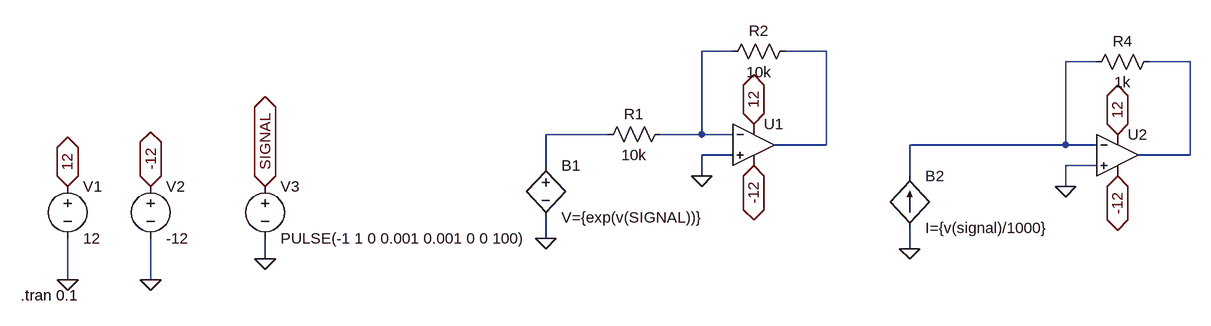
[diagram p0: schematic Arbitrary sources.asc]
Arbitrary sources.asc, the LTspice schematic file:
Version 4
SHEET 1 1140 680
WIRE 432 -64 384 -64
WIRE 576 -64 512 -64
WIRE 992 -48 944 -48
WIRE 1136 -48 1072 -48
WIRE 240 64 144 64
WIRE 384 64 384 -64
WIRE 384 64 320 64
WIRE 432 64 384 64
WIRE 576 80 576 -64
WIRE 576 80 496 80
WIRE 944 80 944 -48
WIRE 944 80 704 80
WIRE 992 80 944 80
WIRE 432 96 384 96
WIRE 1136 96 1136 -48
WIRE 1136 96 1056 96
WIRE 144 112 144 64
WIRE 992 112 944 112
WIRE 384 128 384 96
WIRE 704 128 704 80
WIRE 944 144 944 112
WIRE 144 224 144 192
WIRE 704 240 704 208
WIRE -288 256 -288 224
WIRE -592 288 -592 224
WIRE -464 288 -464 224
FLAG 384 128 0
FLAG -592 288 0
FLAG -464 288 0
FLAG -592 144 12
IOPIN -592 144 BiDir
FLAG -464 144 -12
IOPIN -464 144 BiDir
FLAG 144 224 0
FLAG 464 112 -12
IOPIN 464 112 BiDir
FLAG 464 48 12
IOPIN 464 48 BiDir
FLAG 944 144 0
FLAG 704 240 0
FLAG 1024 128 -12
IOPIN 1024 128 BiDir
FLAG 1024 64 12
IOPIN 1024 64 BiDir
FLAG -288 256 0
FLAG -288 144 SIGNAL
IOPIN -288 144 BiDir
SYMBOL bv 144 96 R0
SYMATTR InstName B1
SYMATTR Value V={exp(v(SIGNAL))}
SYMBOL res 336 48 R90
WINDOW 0 0 56 VBottom 2
WINDOW 3 32 56 VTop 2
SYMATTR InstName R1
SYMATTR Value 10k
SYMBOL res 528 -80 R90
WINDOW 0 0 56 VBottom 2
WINDOW 3 32 56 VTop 2
SYMATTR InstName R2
SYMATTR Value 10k
SYMBOL Opamps\\UniversalOpamp2 464 80 R0
SYMATTR InstName U1
SYMBOL voltage -592 128 R0
SYMATTR InstName V1
SYMATTR Value 12
SYMBOL voltage -464 128 R0
SYMATTR InstName V2
SYMATTR Value -12
SYMBOL res 1088 -64 R90
WINDOW 0 0 56 VBottom 2
WINDOW 3 32 56 VTop 2
SYMATTR InstName R4
SYMATTR Value 1k
SYMBOL Opamps\\UniversalOpamp2 1024 96 R0
SYMATTR InstName U2
SYMBOL voltage -288 128 R0
WINDOW 123 0 0 Left 0
WINDOW 39 0 0 Left 0
SYMATTR InstName V3
SYMATTR Value PULSE(-1 1 0 0.001 0.001 0 0 100)
SYMBOL bi2 704 128 R0
SYMATTR InstName B2
SYMATTR Value I={v(signal)/1000}
TEXT -664 312 Left 2 !.tran 0.1

The netlist it stands for:
* Arbitrary sources.asc
B1 N005 0 V={exp(v(SIGNAL))}
R1 N001 N005 10k
R2 N002 N001 10k
XU1 0 N001 12 -12 N002 level.2 Avol=1Meg GBW=10Meg Slew=10Meg ilimit=25m rail=0 Vos=0 phimargin=45 en=0 enk=0 in=0 ink=0 Rin=500Meg  ; pins IN+ IN- V+ V- OUT
V1 12 0 12
V2 -12 0 -12
R4 N004 N003 1k
XU2 0 N003 12 -12 N004 level.2 Avol=1Meg GBW=10Meg Slew=10Meg ilimit=25m rail=0 Vos=0 phimargin=45 en=0 enk=0 in=0 ink=0 Rin=500Meg  ; pins IN+ IN- V+ V- OUT
V3 SIGNAL 0 PULSE(-1 1 0 0.001 0.001 0 0 100)
B2 0 N003 I={v(signal)/1000}
.tran 0.1
.lib UniversalOpamps2.sub
.backanno
.end